# EAGLE design ALU (EAGLE 6.5.0)
Simple 4Bit ALU for logic Gate CPU.
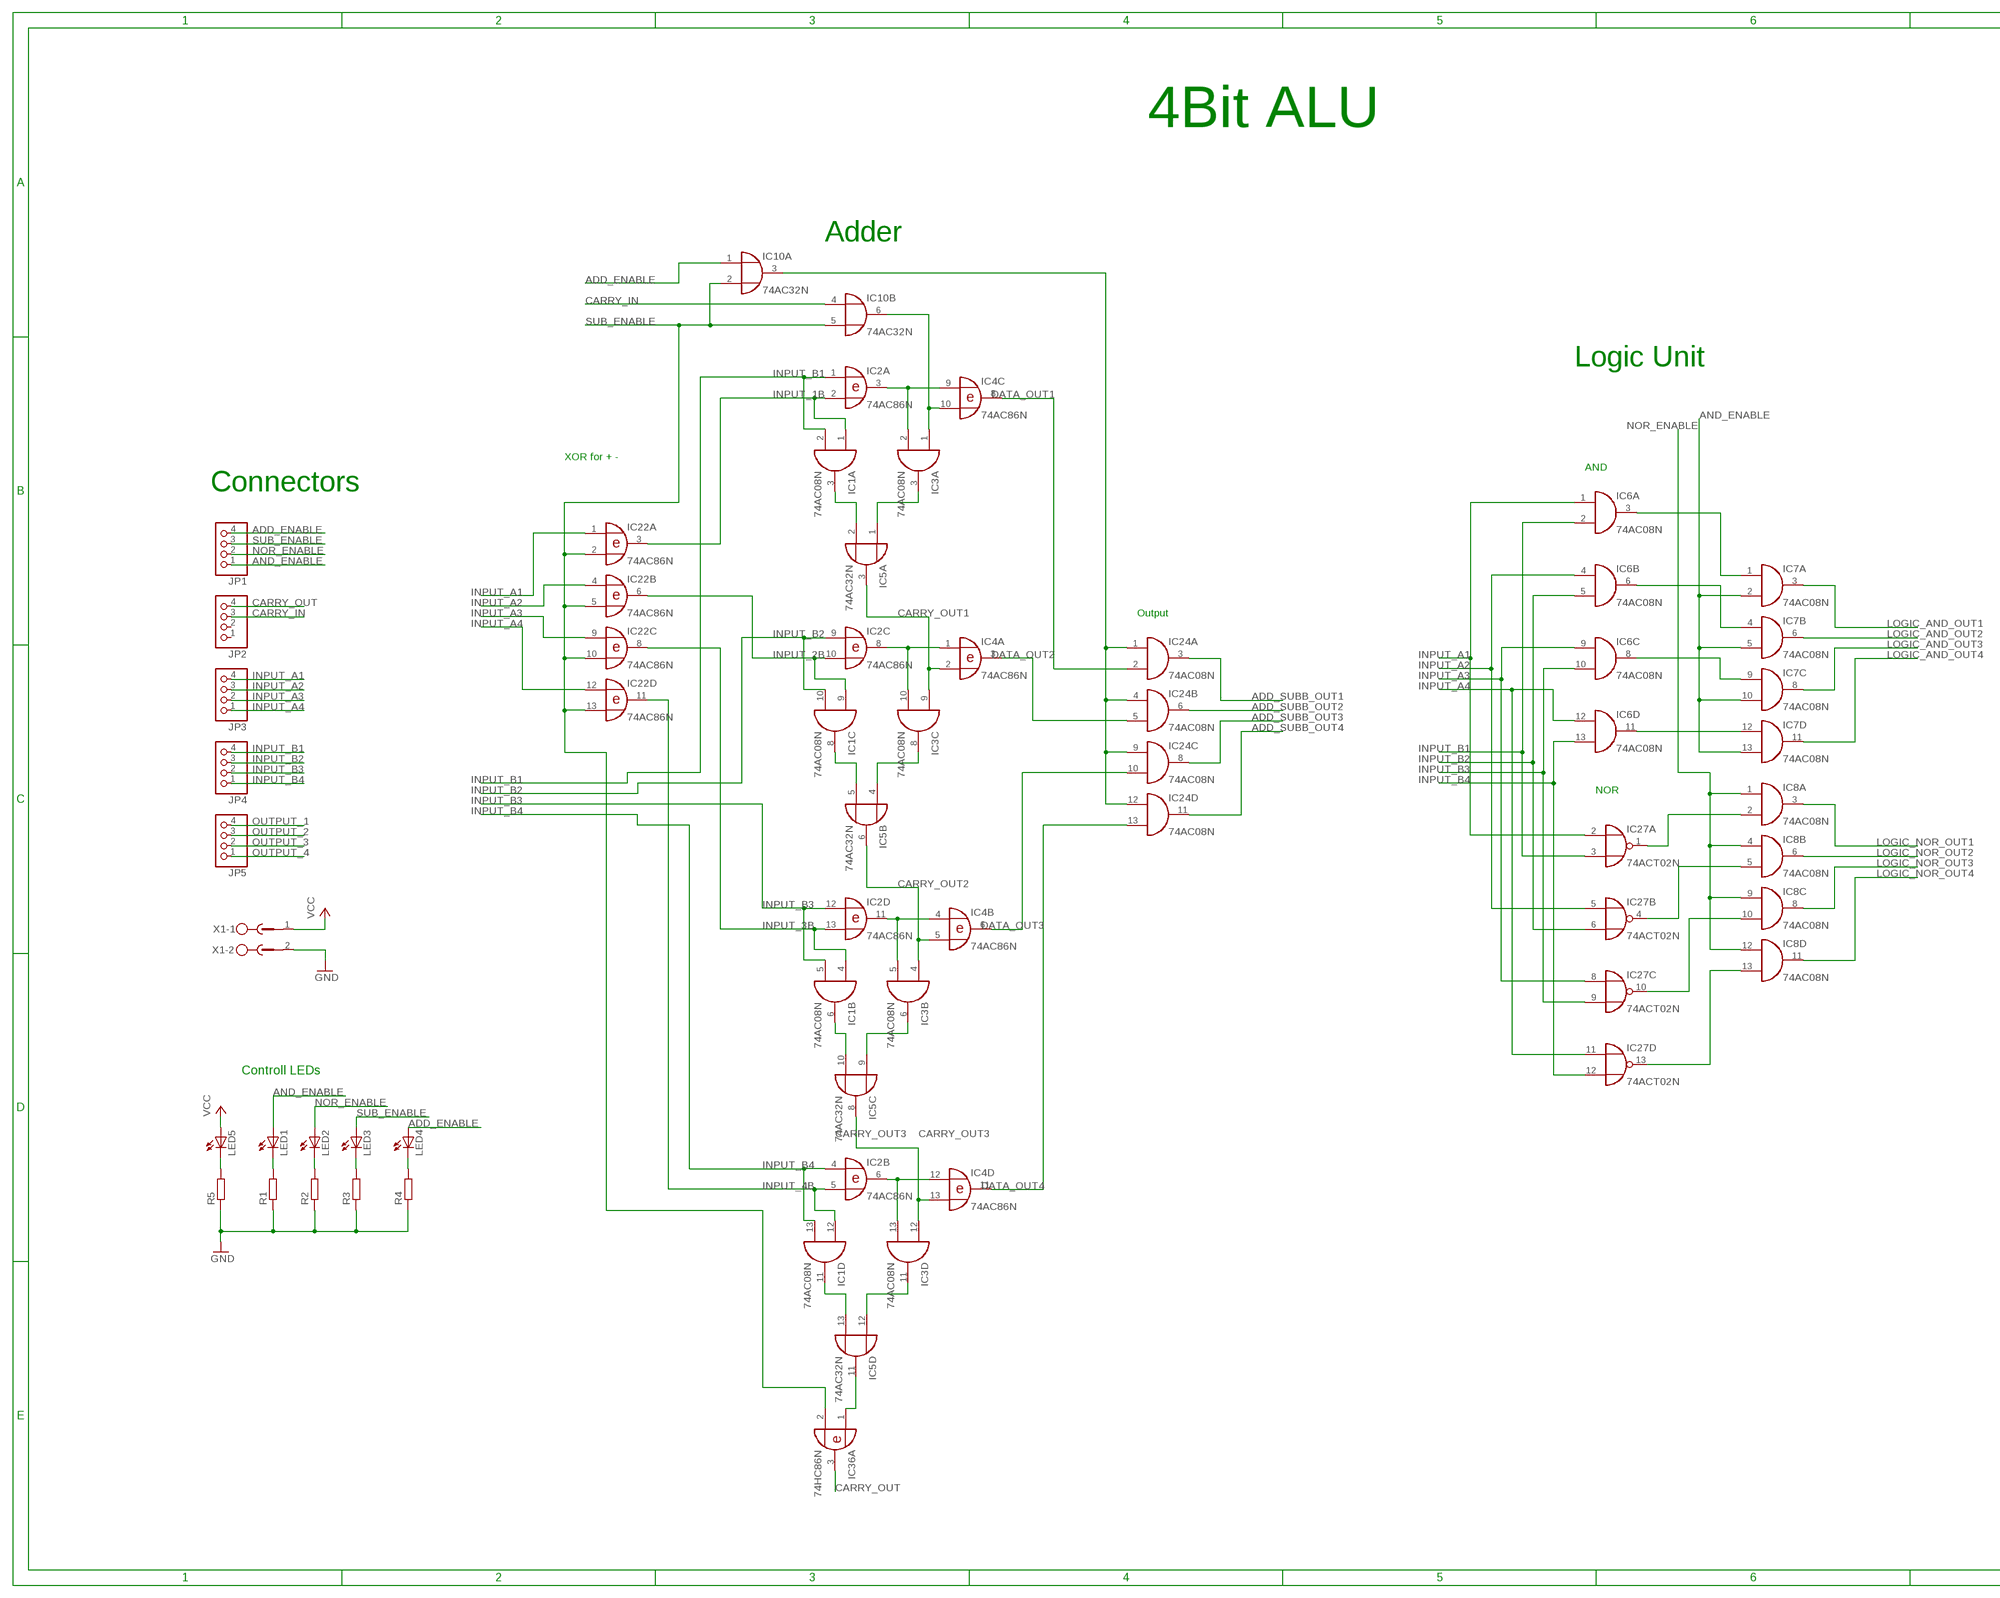
[diagram p0: schematic, sheet 1, part 1 of 2]
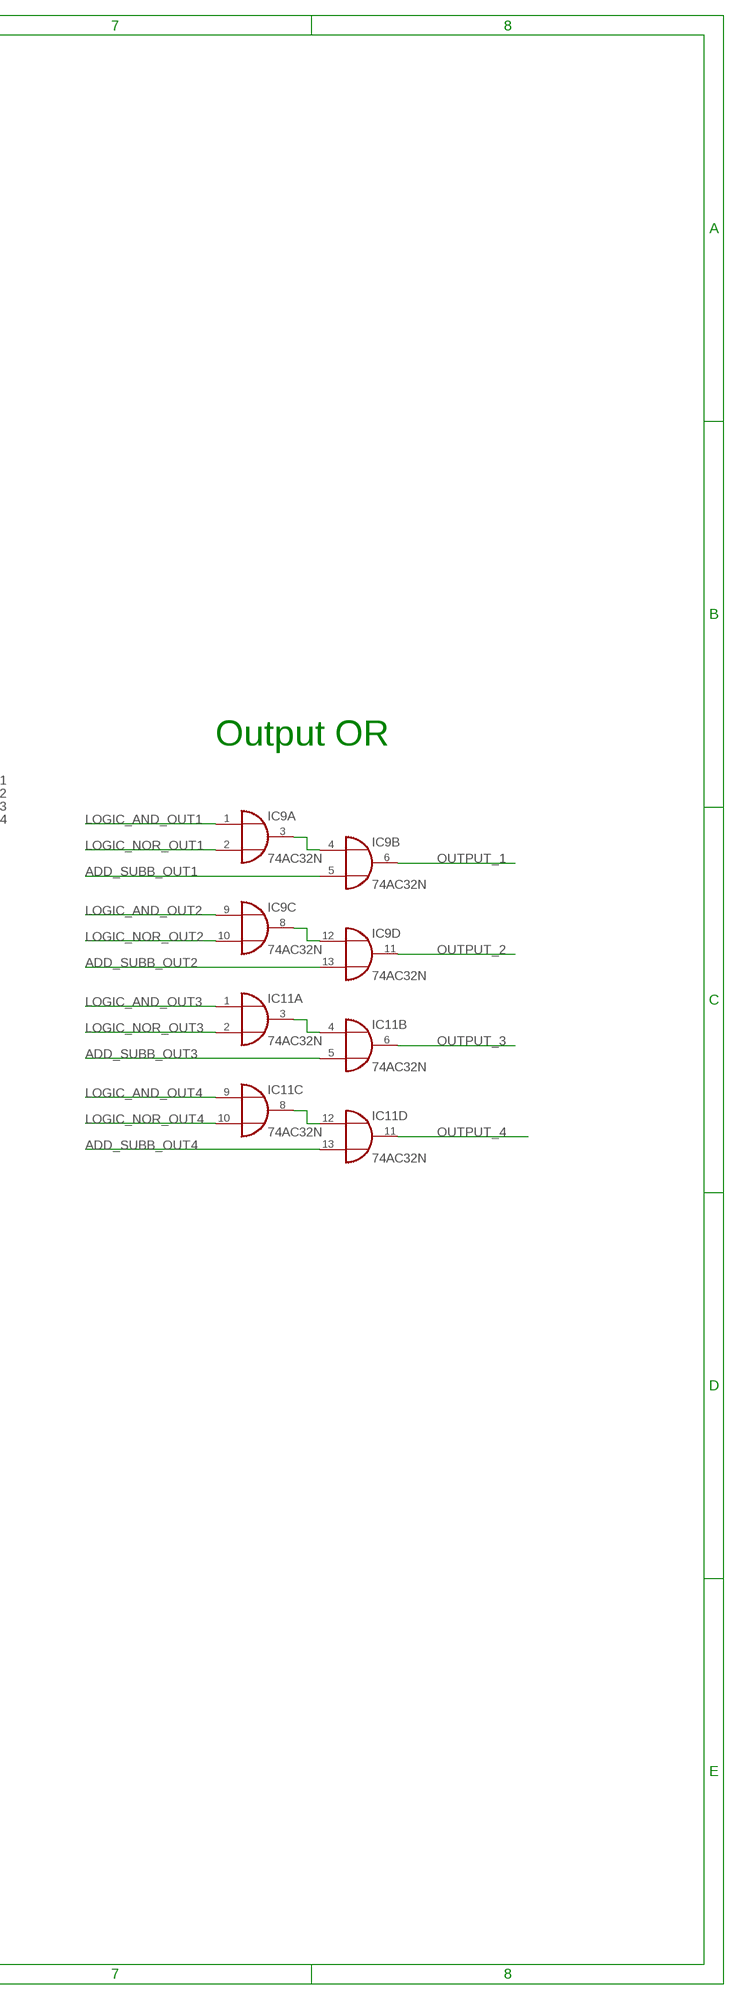
[diagram p1: schematic, sheet 1, part 2 of 2]

## Parts
IC1  74AC08N  [DIL14]
IC2  74AC86N  [DIL14]
IC3  74AC08N  [DIL14]
IC4  74AC86N  [DIL14]
IC5  74AC32N  [DIL14]
IC6  74AC08N  [DIL14]
IC7  74AC08N  [DIL14]
IC8  74AC08N  [DIL14]
IC9  74AC32N  [DIL14]
IC10  74AC32N  [DIL14]
IC11  74AC32N  [DIL14]
IC22  74AC86N  [DIL14]
IC24  74AC08N  [DIL14]
IC27  74ACT02N  [DIL14]
IC36  74HC86N  [DIL14]
JP1  PINHD-1X4  [1X04]
JP2  PINHD-1X4  [1X04]
JP3  PINHD-1X4  [1X04]
JP4  PINHD-1X4  [1X04]
JP5  PINHD-1X4  [1X04]
LED1  LED5MM  [LED5MM]
LED2  LED5MM  [LED5MM]
LED3  LED5MM  [LED5MM]
LED4  LED5MM  [LED5MM]
LED5  LED5MM  [LED5MM]
R1  R-EU_0204/5  [0204/5]
R2  R-EU_0204/5  [0204/5]
R3  R-EU_0204/5  [0204/5]
R4  R-EU_0204/5  [0204/5]
R5  R-EU_0204/5  [0204/5]
X1  MSTBV2  [MSTBV2]

## Nets
______________: IC5.11(D:O) IC36.1(A:I0)
ADD_ENABLE: IC10.1(A:I0) JP1.4 LED4.A
ADD_SUB_ENABLE: IC10.3(A:O) IC24.1(A:I0) IC24.4(B:I0) IC24.9(C:I0) IC24.12(D:I0)
ADD_SUBB_OUT1: IC9.5(B:I1) IC24.3(A:O)
ADD_SUBB_OUT2: IC9.13(D:I1) IC24.6(B:O)
ADD_SUBB_OUT3: IC11.5(B:I1) IC24.8(C:O)
ADD_SUBB_OUT4: IC11.13(D:I1) IC24.11(D:O)
AND_ENABLE: IC7.2(A:I1) IC7.5(B:I1) IC7.10(C:I1) IC7.13(D:I1) JP1.1 LED1.A
CARRY_IN: IC10.4(B:I0) JP2.3
CARRY_OUT: IC36.3(A:O) JP2.4
CARRY_OUT1: IC3.9(C:I0) IC4.2(A:I1) IC5.3(A:O)
CARRY_OUT2: IC3.4(B:I0) IC4.5(B:I1) IC5.6(B:O)
CARRY_OUT3: IC3.12(D:I0) IC4.13(D:I1) IC5.8(C:O)
DATA_OUT1: IC4.8(C:O) IC24.2(A:I1)
DATA_OUT2: IC4.3(A:O) IC24.5(B:I1)
DATA_OUT3: IC4.6(B:O) IC24.10(C:I1)
DATA_OUT4: IC4.11(D:O) IC24.13(D:I1)
GND: R1.1 R2.1 R3.1 R4.1 R5.1 X1.2
INPUT_1B: IC1.1(A:I0) IC2.2(A:I1) IC22.3(A:O)
INPUT_2B: IC1.9(C:I0) IC2.10(C:I1) IC22.6(B:O)
INPUT_3B: IC1.4(B:I0) IC2.13(D:I1) IC22.8(C:O)
INPUT_4B: IC1.12(D:I0) IC2.5(B:I1) IC22.11(D:O)
INPUT_A1: IC6.1(A:I0) IC22.1(A:I0) IC27.2(A:I0) JP3.4
INPUT_A2: IC6.4(B:I0) IC22.4(B:I0) IC27.5(B:I0) JP3.3
INPUT_A3: IC6.9(C:I0) IC22.9(C:I0) IC27.8(C:I0) JP3.2
INPUT_A4: IC6.12(D:I0) IC22.12(D:I0) IC27.11(D:I0) JP3.1
INPUT_B1: IC1.2(A:I1) IC2.1(A:I0) IC6.2(A:I1) IC27.3(A:I1) JP4.4
INPUT_B2: IC1.10(C:I1) IC2.9(C:I0) IC6.5(B:I1) IC27.6(B:I1) JP4.3
INPUT_B3: IC1.5(B:I1) IC2.12(D:I0) IC6.10(C:I1) IC27.9(C:I1) JP4.2
INPUT_B4: IC1.13(D:I1) IC2.4(B:I0) IC6.13(D:I1) IC27.12(D:I1) JP4.1
LOGIC_AND_OUT1: IC7.3(A:O) IC9.1(A:I0)
LOGIC_AND_OUT2: IC7.6(B:O) IC9.9(C:I0)
LOGIC_AND_OUT3: IC7.8(C:O) IC11.1(A:I0)
LOGIC_AND_OUT4: IC7.11(D:O) IC11.9(C:I0)
LOGIC_NOR_OUT1: IC8.3(A:O) IC9.2(A:I1)
LOGIC_NOR_OUT2: IC8.6(B:O) IC9.10(C:I1)
LOGIC_NOR_OUT3: IC8.8(C:O) IC11.2(A:I1)
LOGIC_NOR_OUT4: IC8.11(D:O) IC11.10(C:I1)
N$1: IC1.3(A:O) IC5.2(A:I1)
N$2: IC3.3(A:O) IC5.1(A:I0)
N$3: IC2.3(A:O) IC3.2(A:I1) IC4.9(C:I0)
N$4: IC3.8(C:O) IC5.4(B:I0)
N$5: IC1.8(C:O) IC5.5(B:I1)
N$6: IC2.8(C:O) IC3.10(C:I1) IC4.1(A:I0)
N$7: IC3.6(B:O) IC5.9(C:I0)
N$8: IC1.6(B:O) IC5.10(C:I1)
N$9: IC2.11(D:O) IC3.5(B:I1) IC4.4(B:I0)
N$10: IC3.11(D:O) IC5.12(D:I0)
N$11: IC1.11(D:O) IC5.13(D:I1)
N$12: IC2.6(B:O) IC3.13(D:I1) IC4.12(D:I0)
N$13: IC9.3(A:O) IC9.4(B:I0)
N$14: IC9.8(C:O) IC9.12(D:I0)
N$15: IC11.3(A:O) IC11.4(B:I0)
N$16: IC11.8(C:O) IC11.12(D:I0)
N$17: LED1.K(C) R1.2
N$20: LED2.K(C) R2.2
N$23: IC6.6(B:O) IC7.4(B:I0)
N$24: IC6.8(C:O) IC7.9(C:I0)
N$25: IC6.3(A:O) IC7.1(A:I0)
N$26: IC6.11(D:O) IC7.12(D:I0)
N$27: LED3.K(C) R3.2
N$28: IC8.5(B:I1) IC27.4(B:O)
N$29: IC8.10(C:I1) IC27.10(C:O)
N$30: IC8.13(D:I1) IC27.13(D:O)
N$31: IC8.2(A:I1) IC27.1(A:O)
N$34: LED4.K(C) R4.2
N$37: LED5.K(C) R5.2
N$53: IC3.1(A:I0) IC4.10(C:I1) IC10.6(B:O)
NOR_ENABLE: IC8.1(A:I0) IC8.4(B:I0) IC8.9(C:I0) IC8.12(D:I0) JP1.2 LED2.A
OUTPUT_1: IC9.6(B:O) JP5.4
OUTPUT_2: IC9.11(D:O) JP5.3
OUTPUT_3: IC11.6(B:O) JP5.2
OUTPUT_4: IC11.11(D:O) JP5.1
SUB_ENABLE: IC10.2(A:I1) IC10.5(B:I1) IC22.2(A:I1) IC22.5(B:I1) IC22.10(C:I1) IC22.13(D:I1) IC36.2(A:I1) JP1.3 LED3.A
VCC: LED5.A X1.1
Unconnected: IC10.8(C:O) IC10.9(C:I0) IC10.10(C:I1) IC10.11(D:O) IC10.12(D:I0) IC10.13(D:I1) IC36.4(B:I0) IC36.5(B:I1) IC36.6(B:O) IC36.8(C:O) IC36.9(C:I0) IC36.10(C:I1) IC36.11(D:O) IC36.12(D:I0) IC36.13(D:I1) JP2.1 JP2.2

## Notes on the sheet
- 4Bit ALU
- Adder
- Logic Unit
- XOR for + -
- AND
- Connectors
- Output OR
- Output
- NOR
- Controll LEDs

## Power pins joined to a net without a drawn wire
GND: IC1.7(P:GND) IC2.7(P:GND) IC3.7(P:GND) IC4.7(P:GND) IC5.7(P:GND) IC6.7(P:GND) IC7.7(P:GND) IC8.7(P:GND) IC9.7(P:GND) IC10.7(P:GND) IC11.7(P:GND) IC22.7(P:GND) IC24.7(P:GND) IC27.7(P:GND) IC36.7(P:GND)
VCC: IC1.14(P:VCC) IC2.14(P:VCC) IC3.14(P:VCC) IC4.14(P:VCC) IC5.14(P:VCC) IC6.14(P:VCC) IC7.14(P:VCC) IC8.14(P:VCC) IC9.14(P:VCC) IC10.14(P:VCC) IC11.14(P:VCC) IC22.14(P:VCC) IC24.14(P:VCC) IC27.14(P:VCC) IC36.14(P:VCC)

## Library data of the parts
IC1 IC3 IC6-IC8 IC24 = 74xx-eu:74*08: Quad 2-input AND gate
IC2 IC4 IC22 IC36 = 74xx-eu:74*86: Quad 2-input EXCLUSIVE-OR (XOR) gate
IC5 IC9-IC11 = 74xx-eu:74*32: Quad 2-input OR gate
IC27 = 74xx-eu:74*02: Quad 2-input NOR gate
JP1-JP5 = pinhead:PINHD-1X4: PIN HEADER
LED1-LED5 = led:LED: LED OSRAM: - CHIPLED LG R971, LG N971, LY N971, LG Q971, LY Q971, LO R971, LY R971 LH N974, LH R974 LS Q976, LO Q976, LY Q976 LO Q996 - Hyper CHIPLED LW Q18S LB Q993, LB Q99A, LB R99A - SideLED LS A670, LO A670, LY A670, LG A670, LP A670 LB A673, LV A673, LT A673, LW A673 LH A674 LY A675 LS A676, LA A676, LO A676, LY A676, LW A676 LS A679, LY A679, LG A679 - Hyper Micro SIDELED® LS Y876, LA Y876, LO Y876, LY Y876 LT Y87S - SmartLED LW L88C, LW L88S LB L89C, LB L89S, LG L890 LS L89K, LO L89K, LY L89K LS L896, LA L896, LO L896, LY L896 - TOPLED LS T670, LO T670, LY T670, LG T670, LP T670 LSG T670, LSP T670, LSY T670, LOP T670, LYG T670 LG T671, LOG T671, LSG T671 LB T673, LV T673, LT T673, LW T673 LH T674 LS T676, LA T676, LO T676, LY T676, LB T676, LH T676, LSB T676, LW T676 LB T67C, LV T67C, LT T67C, LS T67K, LO T67K, LY T67K, LW E67C LS E67B, LA E67B, LO E67B, LY E67B, LB E67C, LV E67C, LT E67C LW T67C LS T679, LY T679, LG T679 LS T770, LO T770, LY T770, LG T770, LP T770 LB T773, LV T773, LT T773, LW T773 LH T774 LS E675, LA E675, LY E675, LS T675 LS T776, LA T776, LO T776, LY T776, LB T776 LHGB T686 LT T68C, LB T68C - Hyper Mini TOPLED® LB M676 - Mini TOPLED Santana® LG M470 LS M47K, LO M47K, LY M47K Source: http://www.osram.convergy.de LUXEON: - LUMILED® LXK2-PW12-R00, LXK2-PW12-S00, LXK2-PW14-U00, LXK2-PW14-V00 LXK2-PM12-R00, LXK2-PM12-S00, LXK2-PM14-U00 LXK2-PE12-Q00, LXK2-PE12-R00, LXK2-PE12-S00, LXK2-PE14-T00, LXK2-PE14-U00 LXK2-PB12-K00, LXK2-PB12-L00, LXK2-PB12-M00, LXK2-PB14-N00, LXK2-PB14-P00, LXK2-PB14-Q00 LXK2-PR12-L00, LXK2-PR12-M00, LXK2-PR14-Q00, LXK2-PR14-R00 LXK2-PD12-Q00, LXK2-PD12-R00, LXK2-PD12-S00 LXK2-PH12-R00, LXK2-PH12-S00 LXK2-PL12-P00, LXK2-PL12-Q00, LXK2-PL12-R00 Source: www.luxeon.com KINGBRIGHT: KA-3528ASYC Source: www.kingbright.com
R1-R5 = resistor:R-EU_: RESISTOR, European symbol
X1 = con-phoenix-500:MSTBV2: PHOENIX; OC_FARNELL: unknown; OC_NEWARK: unknown

## Board
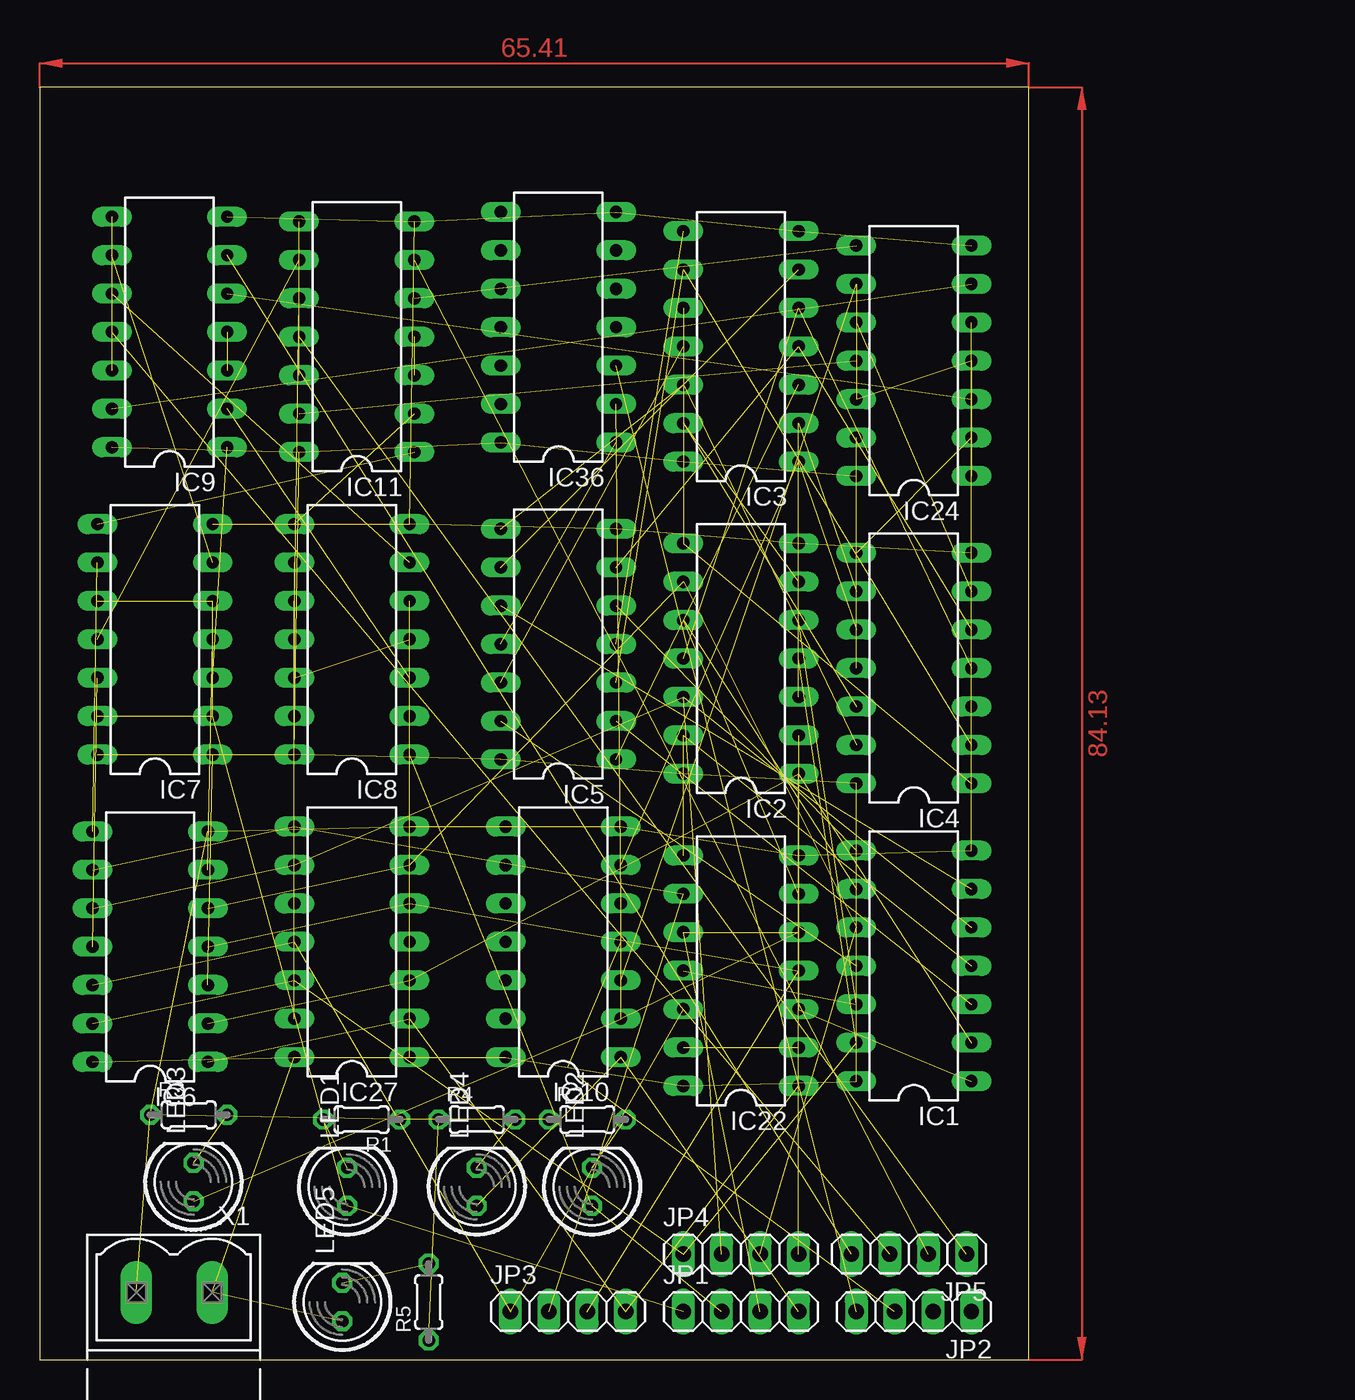
[diagram p2: board, top side]
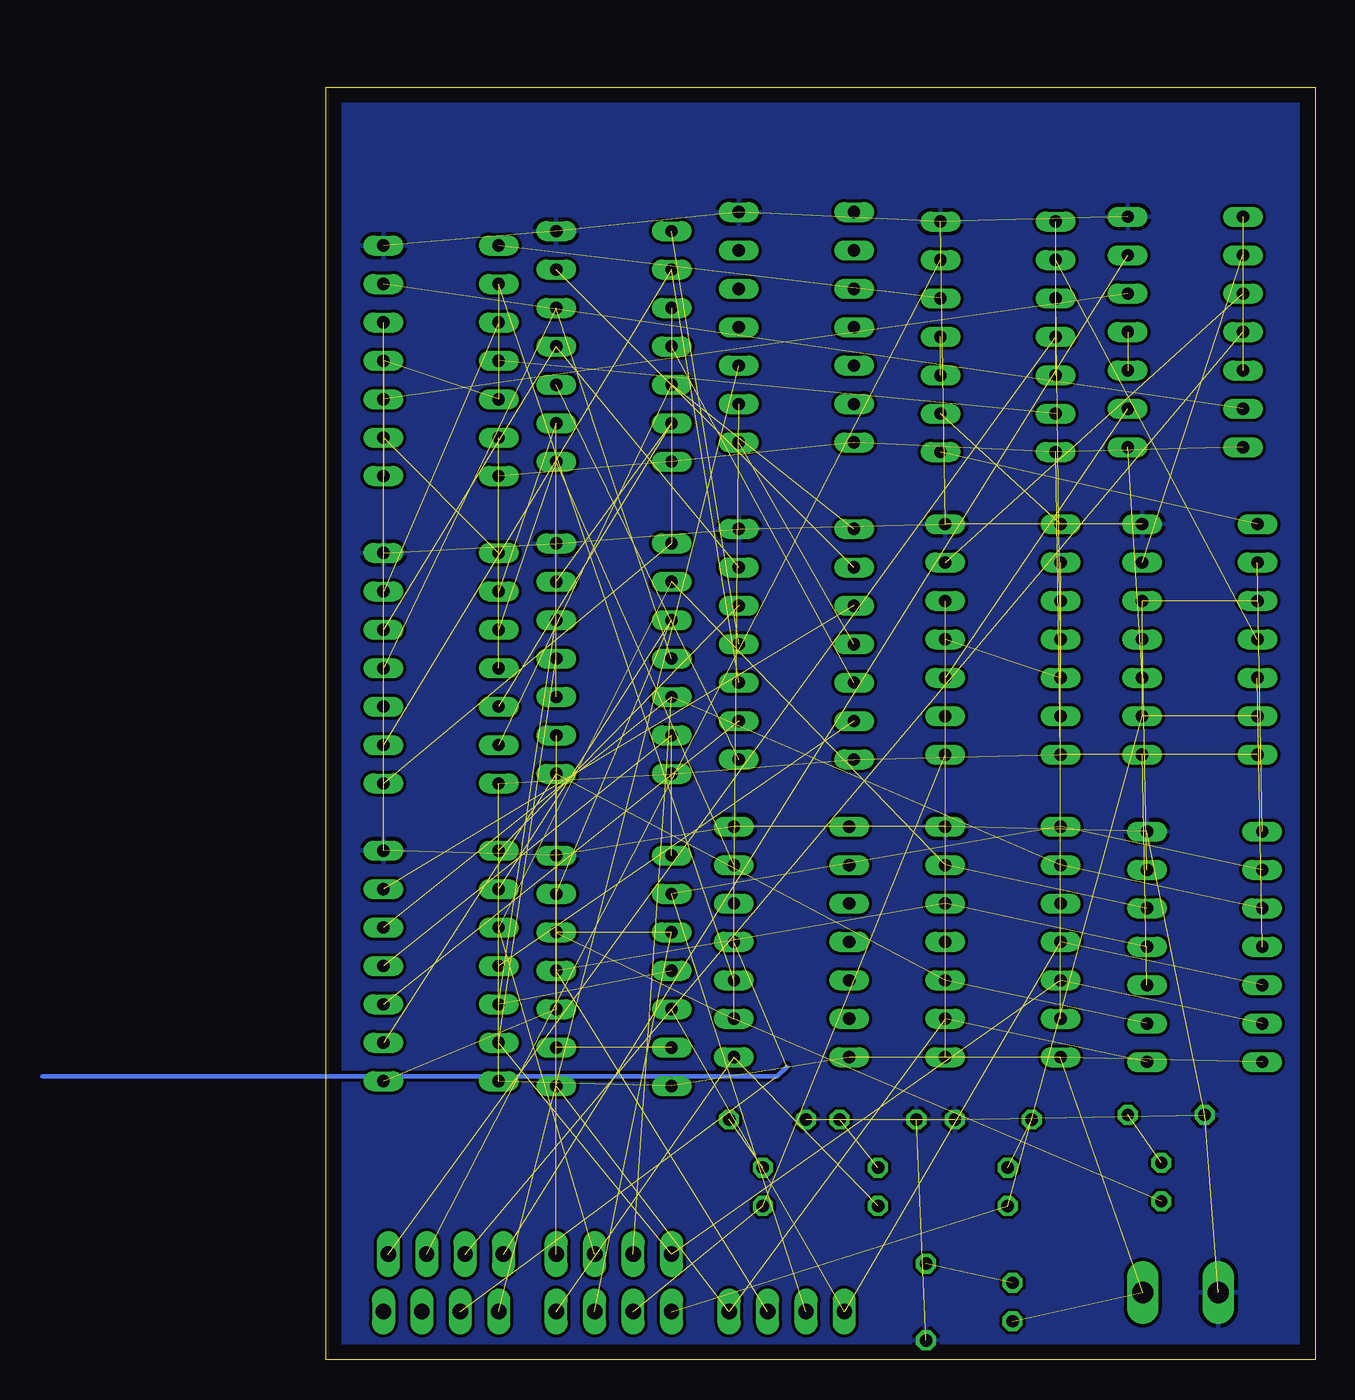
[diagram p3: board, bottom side, seen from below]

Size 65.39 x 84.13 mm. Coordinates in mm from the lower left corner, seen from the top.
Outline: 0,0 65.39,0 65.39,84.13 0,84.13 0,0
Copper layers (1*16): Top 0.035mm / dielectric 1.5mm / Bottom 0.035mm
Design rules: minimum track width 10mil, minimum drill 24mil, track to track 8mil, track to pad 8mil, pad to pad 8mil, via to via 8mil, smd to smd 8mil, copper to edge 40mil, drill to drill 8mil, minimum pad ring 10mil, minimum via ring 8mil, stop-mask expansion 4mil, vias tented up to drill 0mil, thermal gap 10mil

### Footprints (pad centres in the part's own frame; a part is rotated, then mirrored left to right if it is on the bottom)
DIL14 = drill 0.813 long: 1 -7.62,-3.81; 2 -5.08,-3.81; 3 -2.54,-3.81; 4 0,-3.81; 5 2.54,-3.81; 6 5.08,-3.81; 7 7.62,-3.81; 8 7.62,3.81; 9 5.08,3.81; 10 2.54,3.81; 11 0,3.81; 12 -2.54,3.81; 13 -5.08,3.81; 14 -7.62,3.81
1X04 = drill 1.016 long: 1 -3.81,0; 2 -1.27,0; 3 1.27,0; 4 3.81,0
LED5MM = drill 0.813 octagon: A -1.27,0; K 1.27,0
0204/5 = drill 0.813 octagon: 1 -2.54,0; 2 2.54,0
MSTBV2 = drill 1.397 long: 1 -2.5,0; 2 2.5,0

### Placement (x,y rotation side)
IC1  57.79,26.04 90 top
IC2  46.35,46.35 90 top
IC3  46.35,66.99 90 top
IC4  57.79,45.72 90 top
IC5  34.29,47.31 90 top
IC6  7.3,27.3 90 top
IC7  7.62,47.62 90 top
IC8  20.64,47.62 90 top
IC9  8.57,67.94 90 top
IC10  34.61,27.62 90 top
IC11  20.95,67.63 90 top
IC22  46.35,25.72 90 top
IC24  57.79,66.04 90 top
IC27  20.64,27.62 90 top
IC36  34.29,68.26 90 top
JP1  46.35,3.17 0 top
JP2  57.79,3.17 180 top
JP3  34.93,3.17 0 top
JP4  46.35,6.99 0 top
JP5  57.47,6.99 180 top
LED1  20.32,11.43 90 top
LED2  36.51,11.43 90 top
LED3  10.16,11.75 90 top
LED4  28.89,11.43 90 top
LED5  20,3.81 90 top
R1  21.27,15.88 180 top
R2  36.2,15.88 0 top
R3  9.84,16.19 0 top
R4  28.89,15.88 0 top
R5  25.72,3.81 90 top
X1  8.89,4.45 180 top

### Tracks (layer width: path | path; a pad name or v marks a point on that pad's centre or on a via)
______________  (1 unrouted)
ADD_ENABLE  (2 unrouted)
ADD_SUB_ENABLE  (4 unrouted)
ADD_SUBB_OUT1  (1 unrouted)
ADD_SUBB_OUT2  (1 unrouted)
ADD_SUBB_OUT3  (1 unrouted)
ADD_SUBB_OUT4  (1 unrouted)
AND_ENABLE  (5 unrouted)
CARRY_IN  (2 unrouted)
  Bottom 0.305: 34.93,19.37 35.56,18.73 84.14,18.73
CARRY_OUT  (1 unrouted)
CARRY_OUT1  (2 unrouted)
CARRY_OUT2  (2 unrouted)
CARRY_OUT3  (2 unrouted)
DATA_OUT1  (1 unrouted)
DATA_OUT2  (1 unrouted)
DATA_OUT3  (1 unrouted)
DATA_OUT4  (1 unrouted)
GND  (20 unrouted)
  pour Bottom: -144.15,115.89 -143.83,115.89 -143.83,-33.97 117.47,-33.97 117.47,-26.35 116.52,-26.35 116.52,126.05 -144.15,126.05
INPUT_1B  (2 unrouted)
INPUT_2B  (2 unrouted)
INPUT_3B  (2 unrouted)
INPUT_4B  (2 unrouted)
INPUT_A1  (3 unrouted)
INPUT_A2  (3 unrouted)
INPUT_A3  (3 unrouted)
INPUT_A4  (3 unrouted)
INPUT_B1  (4 unrouted)
INPUT_B2  (4 unrouted)
INPUT_B3  (4 unrouted)
INPUT_B4  (4 unrouted)
LOGIC_AND_OUT1  (1 unrouted)
LOGIC_AND_OUT2  (1 unrouted)
LOGIC_AND_OUT3  (1 unrouted)
LOGIC_AND_OUT4  (1 unrouted)
LOGIC_NOR_OUT1  (1 unrouted)
LOGIC_NOR_OUT2  (1 unrouted)
LOGIC_NOR_OUT3  (1 unrouted)
LOGIC_NOR_OUT4  (1 unrouted)
N$1  (1 unrouted)
N$2  (1 unrouted)
N$3  (2 unrouted)
N$4  (1 unrouted)
N$5  (1 unrouted)
N$6  (2 unrouted)
N$7  (1 unrouted)
N$8  (1 unrouted)
N$9  (2 unrouted)
N$10  (1 unrouted)
N$11  (1 unrouted)
N$12  (2 unrouted)
N$13  (1 unrouted)
N$14  (1 unrouted)
N$15  (1 unrouted)
N$16  (1 unrouted)
N$17  (1 unrouted)
N$20  (1 unrouted)
N$23  (1 unrouted)
N$24  (1 unrouted)
N$25  (1 unrouted)
N$26  (1 unrouted)
N$27  (1 unrouted)
N$28  (1 unrouted)
N$29  (1 unrouted)
N$30  (1 unrouted)
N$31  (1 unrouted)
N$34  (1 unrouted)
N$37  (1 unrouted)
N$53  (2 unrouted)
NOR_ENABLE  (5 unrouted)
OUTPUT_1  (1 unrouted)
OUTPUT_2  (1 unrouted)
OUTPUT_3  (1 unrouted)
OUTPUT_4  (1 unrouted)
SUB_ENABLE  (8 unrouted)
VCC  (16 unrouted)
(copper drawn outside any net)
  shapes: Top area x2